# EAGLE design utility hat (EAGLE 6.3)
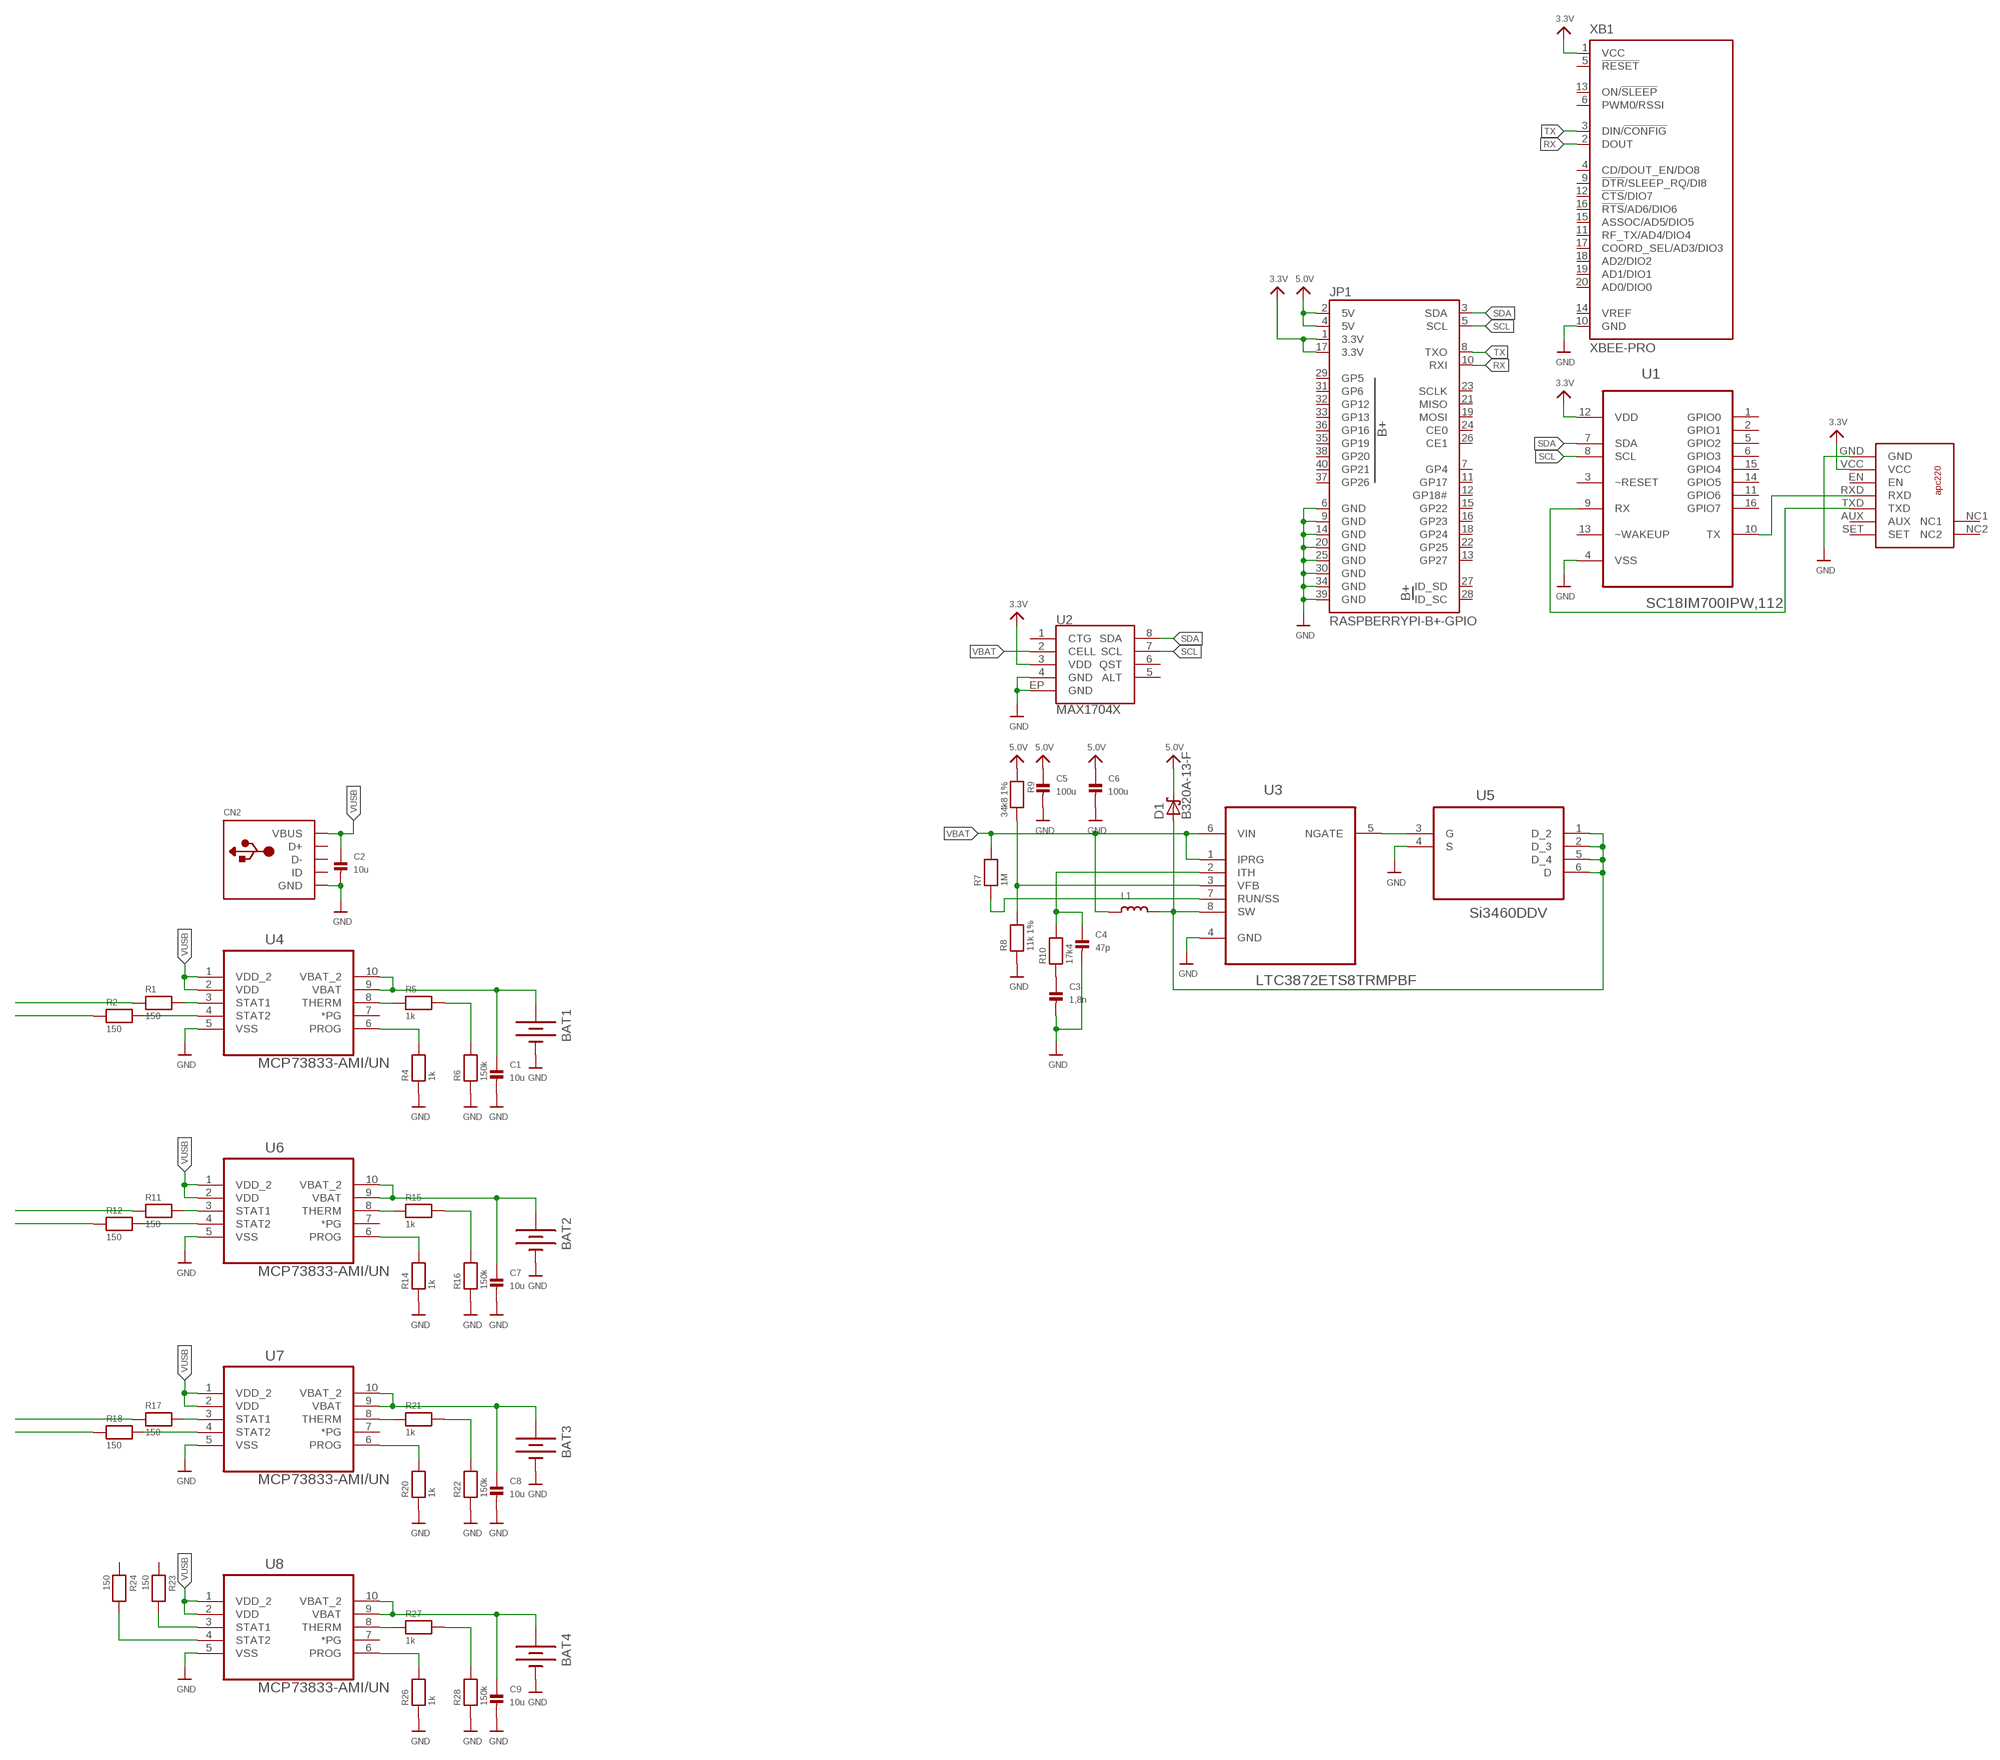
[diagram p0: schematic, sheet 1]

## Parts
BAT1  BATTERY18650  [BATTERY_18650-HOLDER]
BAT2  BATTERY18650  [BATTERY_18650-HOLDER]
BAT3  BATTERY18650  [BATTERY_18650-HOLDER]
BAT4  BATTERY18650  [BATTERY_18650-HOLDER]
C1  10u  CAP_CERAMIC_0805MP  [_0805MP]
C2  10u  CAP_CERAMIC_0805MP  [_0805MP]
C3  1,8n  CAP_CERAMIC_0603MP  [_0603MP]
C4  47p  CAP_CERAMIC_0603MP  [_0603MP]
C5  100u  CAP_CERAMIC1206  [1206]
C6  100u  CAP_CERAMIC1206  [1206]
C7  10u  CAP_CERAMIC_0805MP  [_0805MP]
C8  10u  CAP_CERAMIC_0805MP  [_0805MP]
C9  10u  CAP_CERAMIC_0805MP  [_0805MP]
CN2  USBMINIB  [USB-MINIB]
D1  B320A-13-F  MBRS320T3  [SMC]
JP1  RASPBERRYPI-B+-GPIO  [2X20-SHROUDED]
L1  INDUCTOR  [INDUCTOR_1007]
R1  150  RESISTOR_0603MP  [_0603MP]
R2  150  RESISTOR_0603MP  [_0603MP]
R4  1k  RESISTOR_0603MP  [_0603MP]
R5  1k  RESISTOR_0603MP  [_0603MP]
R6  150k  RESISTOR_0603MP  [_0603MP]
R7  1M  RESISTOR_0603MP  [_0603MP]
R8  11k 1%  RESISTOR_0603MP  [_0603MP]
R9  34k8 1%  RESISTOR_0603MP  [_0603MP]
R10  17k4  RESISTOR_0603MP  [_0603MP]
R11  150  RESISTOR_0603MP  [_0603MP]
R12  150  RESISTOR_0603MP  [_0603MP]
R14  1k  RESISTOR_0603MP  [_0603MP]
R15  1k  RESISTOR_0603MP  [_0603MP]
R16  150k  RESISTOR_0603MP  [_0603MP]
R17  150  RESISTOR_0603MP  [_0603MP]
R18  150  RESISTOR_0603MP  [_0603MP]
R20  1k  RESISTOR_0603MP  [_0603MP]
R21  1k  RESISTOR_0603MP  [_0603MP]
R22  150k  RESISTOR_0603MP  [_0603MP]
R23  150  RESISTOR_0603MP  [_0603MP]
R24  150  RESISTOR_0603MP  [_0603MP]
R26  1k  RESISTOR_0603MP  [_0603MP]
R27  1k  RESISTOR_0603MP  [_0603MP]
R28  150k  RESISTOR_0603MP  [_0603MP]
U1  SC18IM700IPW,112  [SOP65P640X110-16N]
U2  MAX1704X  [TDFN-8]
U3  LTC3872ETS8TRMPBF  [SOT65P280X100-8N]
U4  MCP73833-AMI/UN  [SOP50P490X110-10N]
U5  Si3460DDV  SI3457CDV-T1-GE3  [SOT95P285X110-6N]
U6  MCP73833-AMI/UN  [SOP50P490X110-10N]
U7  MCP73833-AMI/UN  [SOP50P490X110-10N]
U8  MCP73833-AMI/UN  [SOP50P490X110-10N]
U$10  APC220  [APC220]
XB1  XBEE-PRO  [XBEE-PRO]

## Nets
3.3V: JP1.1(3.3V) JP1.17(3.3V) U1.12(VDD) U2.3(VDD) U$10.VCC XB1.1(VCC)
5.0V: C5.1 C6.1 D1.C JP1.2(5V) JP1.4(5V) R9.1
GND: BAT1.GND@1(-) BAT2.GND@1(-) BAT3.GND@1(-) BAT4.GND@1(-) C1.2 C2.2 C3.2 C4.2 C5.2 C6.2 C7.2 C8.2 C9.2 CN2.GND JP1.6(GND) JP1.9(GND) JP1.14(GND) JP1.20(GND) JP1.25(GND) JP1.30(GND) JP1.34(GND) JP1.39(GND) R4.1 R6.1 R8.1 R14.1 R16.1 R20.1 R22.1 R26.1 R28.1 U1.4(VSS) U2.4(GND) U2.EP(GND) U3.4(GND) U4.5(VSS) U5.4(S) U6.5(VSS) U7.5(VSS) U8.5(VSS) U$10.GND XB1.10(GND)
N$1: U1.10(TX) U$10.RXD
N$2: U1.9(RX) U$10.TXD
N$4: R1.2 U4.3(STAT1)
N$5: R2.2 U4.4(STAT2)
N$8: R2.1
N$9: R1.1
N$11: R4.2 U4.6(PROG)
N$12: R5.1 U4.8(THERM)
N$13: R5.2 R6.2
N$14: R7.1 U3.7(RUN/SS)
N$15: R8.2 R9.2 U3.3(VFB)
N$16: C4.1 R10.2 U3.2(ITH)
N$17: C3.1 R10.1
N$19: D1.A L1.P$2 U3.8(SW) U5.1(D_2) U5.2(D_3) U5.5(D_4) U5.6(D)
N$21: U3.5(NGATE) U5.3(G)
N$22: BAT1.PWR@1(+) C1.1 U4.9(VBAT) U4.10(VBAT_2)
N$26: R11.2 U6.3(STAT1)
N$27: R12.2 U6.4(STAT2)
N$30: R12.1
N$31: R11.1
N$32: R14.2 U6.6(PROG)
N$33: R15.1 U6.8(THERM)
N$34: R15.2 R16.2
N$35: BAT2.PWR@1(+) C7.1 U6.9(VBAT) U6.10(VBAT_2)
N$37: R17.2 U7.3(STAT1)
N$38: R18.2 U7.4(STAT2)
N$41: R18.1
N$42: R17.1
N$43: R20.2 U7.6(PROG)
N$44: R21.1 U7.8(THERM)
N$45: R21.2 R22.2
N$46: BAT3.PWR@1(+) C8.1 U7.9(VBAT) U7.10(VBAT_2)
N$48: R23.2 U8.3(STAT1)
N$49: R24.2 U8.4(STAT2)
N$54: R26.2 U8.6(PROG)
N$55: R27.1 U8.8(THERM)
N$56: R27.2 R28.2
N$57: BAT4.PWR@1(+) C9.1 U8.9(VBAT) U8.10(VBAT_2)
RX: JP1.10(RXI) XB1.2(DOUT)
SCL: JP1.5(SCL) U1.8(SCL) U2.7(SCL)
SDA: JP1.3(SDA) U1.7(SDA) U2.8(SDA)
TX: JP1.8(TXO) XB1.3(DIN/!CONFIG)
VBAT: L1.P$1 R7.2 U2.2(CELL) U3.1(IPRG) U3.6(VIN)
VUSB: C2.1 CN2.VBUS U4.1(VDD_2) U4.2(VDD) U6.1(VDD_2) U6.2(VDD) U7.1(VDD_2) U7.2(VDD) U8.1(VDD_2) U8.2(VDD)
Unconnected: CN2.D+ CN2.D- CN2.ID JP1.7(GP4) JP1.11(GP17) JP1.12(GP18#) JP1.13(GP27) JP1.15(GP22) JP1.16(GP23) JP1.18(GP24) JP1.19(MOSI) JP1.21(MISO) JP1.22(GP25) JP1.23(SCLK) JP1.24(CE0) JP1.26(CE1) JP1.27(ID_SD) JP1.28(ID_SC) JP1.29(GP5) JP1.31(GP6) JP1.32(GP12) JP1.33(GP13) JP1.35(GP19) JP1.36(GP16) JP1.37(GP26) JP1.38(GP20) JP1.40(GP21) R23.1 R24.1 U1.1(GPIO0) U1.2(GPIO1) U1.3(~RESET) U1.5(GPIO2) U1.6(GPIO3) U1.11(GPIO6) U1.13(~WAKEUP) U1.14(GPIO5) U1.15(GPIO4) U1.16(GPIO7) U2.1(CTG) U2.5(ALT) U2.6(QST) U4.7(*PG) U6.7(*PG) U7.7(*PG) U8.7(*PG) U$10.AUX U$10.EN U$10.NC1 U$10.NC2 U$10.SET XB1.4(CD/DOUT_EN/DO8) XB1.5(!RESET) XB1.6(PWM0/RSSI) XB1.9(!DTR!/SLEEP_RQ/DI8) XB1.11(RF_TX/AD4/DIO4) XB1.12(!CTS!/DIO7) XB1.13(ON/!SLEEP) XB1.14(VREF) XB1.15(ASSOC/AD5/DIO5) XB1.16(!RTS!/AD6/DIO6) XB1.17(COORD_SEL/AD3/DIO3) XB1.18(AD2/DIO2) XB1.19(AD1/DIO1) XB1.20(AD0/DIO0)

## Library data of the parts
BAT1-BAT4 = SparkFun-Electromechanical:BATTERY: Battery Holders Various common sizes : AA, AAA, 18650 (PRT-12895), 20mm coin cell and 12mm coin cell. 20MM_4LEGS, BATT-10373
C1-C9 = microbuilder:CAP_CERAMIC: Ceramic Capacitors 0402 - 0402 Surface Mount Capacitors 16pF 50V 5% [Digikey: 445-4899-2-ND] 18pF 50V 5% [Digikey: 490-1281-2-ND] 22pF 50V 5% [Digikey: 490-1283-2-ND] 68pF 50V 5% [Digikey: 490-1289-2-ND] 0.1uF 10V 10% [Digikey: 490-1318-2-ND] 1.0uF 6.3V 10% [Digikey: 490-1320-2-ND] 0603 - 0603 Surface Mount Capacitors 16 pF 50V 5% [Digikey: 445-5051-2-ND] 22 pF 50V [Digikey: PCC220ACVTR-ND] 33 pF 50V 5% [Digikey: 490-1415-1-ND] 56pF 50V 5% [Digikey: 490-1421-1-ND] 220pF 50V 5% [Digikey: 445-1285-1-ND] 680 pF 50V 2200 pF 50V 5% C0G [Digikey: 445-1297-1-ND] 5600 pF 100V 5% X7R [Digikey: 478-3711-1-ND] 0.1 µF 25V 10% [Digikey: PCC2277TR-ND] 0.22 µF 16V 10% X7R [Digikey: 445-1318-1-ND] 1.0 µF 25V 10% [Digikey: 445-5146-2-ND] 0603 - RF Specific 3pF 250V +/-0.1pF RF [Digikey: 712-1347-1-ND] 18 pF 250V 5% [Digikey: 478-3505-1-ND or 712-1322-1-ND] 56 pF 250V 5% C0G RF [Digikey: 490-4867-1-ND] 68 pF 250V RF [Digikey: 490-4868-1-ND] 0805 - 0805 Surface Mount Capacitors 220 pF 250V 2% RF Ceramic Capacitor [Digikey: 712-1398-1-ND] 1000 pF 50V 2% NP0 Ceramic Capacitor [Digikey: 478-3760-1-ND] 0.1 µF 25V 10% Ceramic Capacitor [Digikey: PCC1828TR-ND] 1.0 µF 16V 10% Ceramic Capacitor[Digikey: 490-1691-2-ND] 10.0 µF 10V 10% Ceramic Capacitor[Digikey: 709-1228-1-ND] 10.0 uF 16V 10% Ceramic Capacitor [Digikey: 478-5165-2-ND] 47 uF 6.3V 20% Ceramic Capacitor [Digikey: 587-1779-1-ND or 399-5506-1-ND] 1206 - 1206 Surface Mount Capacitors 47uF 10V 20% Ceramic Capacitor [Digikey: 490-5528-1-ND or 399-5508-1-ND or 445-6010-1-ND] 100uF 6.3V -20%, +80% Y5V Ceramic Capacitor (Digikey: 490-4512-1-ND, Mouser: 81-GRM31CF50J107ZE1L)
CN2 = adafruit:USB: USB Connectors USBMINIB - Surface Mount Female Mini-B USB Connector 4UConnector: 06564 By microbuilder.eu Thru-hole RA Female Mini-B USB Connector 4UConnector: 18732 By ladyada.net
D1 = diode:MBRS3*0T3: SCHOTTKY BARRIER RECTIFIER 3.0 AMPERES 20, 30, 40 VOLT Source: MBRS340T3-D.pdf
JP1 = SparkFun-Boards:RASPBERRYPI-B+-GPIO: Raspberry Pi B+ GPIO Header 2x20 pin connector
L1 = microbuilder:INDUCTOR: Inductors 0603: 10nH Ceramic Inductor - microwire antenna/RF (Digikey: 712-1434-2-ND) 0805: 560nH Ceramic Inductor - RF (Digikey: 553-1047-1-ND) 270nH Ceramic Inductor - Q = 40@250MHz, +-5%, 1 Ohm DC Resistance (Digikey: 535-10506-2-ND) 1007 (2518 Metric) SMT: 10µH 10% 250mOhm 820mA 1007 Inductor (Digikey: 587-2189-1-ND) 22µH 10% 500mOhm 580mA 1007 Inductor (Digikey: 587-2190-1-ND) 47µH 10% 950mOhm 420mA 1007 Inductor (Digikey: 587-2191-1-ND) 47µH 5% 100mOhm 1A 1008 Inductor (Digikey: 732-1816-1-ND) 5.0x5.0mm (Taiyo Yuden NR5040 Series) 6.8µH 20% 2.3A 64mOhm Inductor (Digikey: 587-2374-2-ND) 5.0x5.0mm (TDK VLC5045 Series) 4.7µH 20% 3.3A 34mOhm Inductor (Digikey: 445-6526-1-ND) 6.8µH 20% 2.7A 46mOhm Inductor (Digikey: 445-6527-1-ND) 6.0x6.0mm (TDK VLC6045 Series) 4.7µH 20% 3.8A 27mOhm Inductor (Digikey: 445-6538-2-ND) 6.8µH 20% 3A 41mOhm Inductor (Digikey: 445-6540-1-ND) 6.2µH 30% 2.2A 45mOhm Inductor (Digikey: SRR5028-6R2YCT-ND) - Not TDK VLC6045 but footprint should match 6.0x6.0mm (TDK SLF6045 Series) 6.8uH 30% 2A 33mOhm Inductor (Digikey: 445-4572-1-ND, Mouser: 810-SLF645T6R8N2R0PF)
R1 R2 R4-R12 R14-R18 R20-R24 R26-R28 = microbuilder:RESISTOR: Resistors 0402 - 0402 Surface Mount Package 22 Ohm 1% 1/16W [Digikey: 311-22.0LRTR-ND] 33 Ohm 5% 1/16W 1.0K 5% 1/16W 1.5K 5% 1/16W 2.0K 1% 1/16W 10.0K 1% 1/16W [Digikey: 311-10.0KLRTR-ND] 10.0K 5% 1/16W [Digikey: RMCF0402JT10K0TR-ND] 12.1K 1% 1/16W [Digikey: 311-22.0LRTR-ND] 100.0K 5% 1/16W 0603 - 0603 Surface Mount Package 0 Ohm 1/10 Watt 1% Resistor 15 Ohm 1/10 Watt 1% Resistor 33 Ohm 1/10 Watt 1% Resistor 49.9 Ohm 1/10 Watt 1% Resistor 100 Ohm 1/10 Watt 1% Resistor 150 Ohm 1/10 Watt 1% Resistor 240 Ohm 1/10 Watt 1% Resistor 390 Ohm 1/10 Watt 1% Resistor 560 Ohm 1/10 Watt 1% Resistor 680 Ohm 1/10 Watt 1% Resistor 750 Ohm 1/10 Watt 1% Resistor 1.0K Ohm 1/10 Watt 1% Resistor 1.5K Ohm 1/10 Watt 1% Resistor 2.0K Ohm 1/10 Watt 1% Resistor 2.2K Ohm 1/10 Watt 1% Resistor 3.3K Ohm 1/10 Watt 1% Resistor 4.7K Ohm 1/10 Watt 1% Resistor 10.0K Ohm 1/10 Watt 1% Resistor 12.0K Ohm 1/10 Watt 1% Resistor 12.1K Ohm 1/10 Watt 1% Resistor 20.0K Ohm 1/10 Watt 1% Resistor 33.0K Ohm 1/10 Watt 1% Resistor 100.0K Ohm 1/10 Watt 1% Resistor 0805 - 0805 Surface Mount Package 0 Ohm 1/8 Watt 1% Resistor 33 Ohm 1/8 Watt 1% Resistor 100 Ohm 1/8 Watt 1% Resistor 150 Ohm 1/8 Watt 1% Resistor 200 Ohm 1/8 Watt 1% Resistor 240 Ohm 1/8 Watt 1% Resistor 330 Ohm 1/8 Watt 1% Resistor 390 Ohm 1/8 Watt 1% Resistor 470 Ohm 1/8 Watt 1% Resistor 1.0K Ohm 1/8 Watt 1% Resistor 1.5K Ohm 1/8 Watt 1% Resistor 2.0K Ohm 1/8 Watt 1% Resistor 4.7K Ohm 1/8 Watt 1% Resistor 5.1K Ohm 1/8 Watt 1% Resistor 5.6K Ohm 1/8 Watt 1% Resistor 10.0K Ohm 1/8 Watt 1% Resistor 22.0K Ohm 1/8 Watt 1% Resistor 33.0K Ohm 1/8 Watt 1% Resistor 100K Ohm 1/8 Watt 1% Resistor 1206 - 1206 Surface Mount Package 2012 - 2010 Surface Mount Package 0.11 Ohm 1/2 Watt 1% Resistor - Digikey: RHM.11UCT-ND
U1 = NXP_By_element14_Batch_1:SC18IM700IPW,112: Master I2C-bus controller with UART interface; MPN: SC18IM700IPW,112; OC_FARNELL: -; OC_NEWARK: 70R9006; PACKAGE: TSSOP-16; SUPPLIER: NXP
U2 = SparkFun-PowerIC:MAX1704X: MAX17043/MAX17044: Battery Fuel Guage (43 is 1cell, 44 is 2cell); PROD-ID: IC-10399
U3 = LTC_By_element14_Batch_1:LTC3872ETS8TRMPBF: DC/DC Controller; MPN: LTC3872ETS8#TRMPBF; OC_FARNELL: 1556409; OC_NEWARK: 56M8617; PACKAGE: SOT-23-8; SUPPLIER: LINEAR TECHNOLOGY
U4 U6-U8 = Microchip_By_element14_Batch_1:MCP73833-AMI/UN: IC, BATTERY CHARGER, 1A; MPN: MCP73833-AMI/UN; OC_FARNELL: 1332160; OC_NEWARK: 88K5664; PACKAGE: MSOP-10; SUPPLIER: Microchip
U5 = Vishay_By_element14_Batch_1:SI3457CDV-T1-GE3: N-Channel 30-V (D-S) MOSFET; MPN: SI3457CDV-T1-GE3; OC_FARNELL: 1840420; OC_NEWARK: 90R9127; PACKAGE: TSOP-6; SUPPLIER: Vishay Siliconix
U$10 = APC220:APC220
XB1 = microbuilder:XBEE: XBee (TM) /XBee-PRO(TM) OEM RF Modules Source: MaxStream, Inc. xbee_productmanual.pdf

## Board
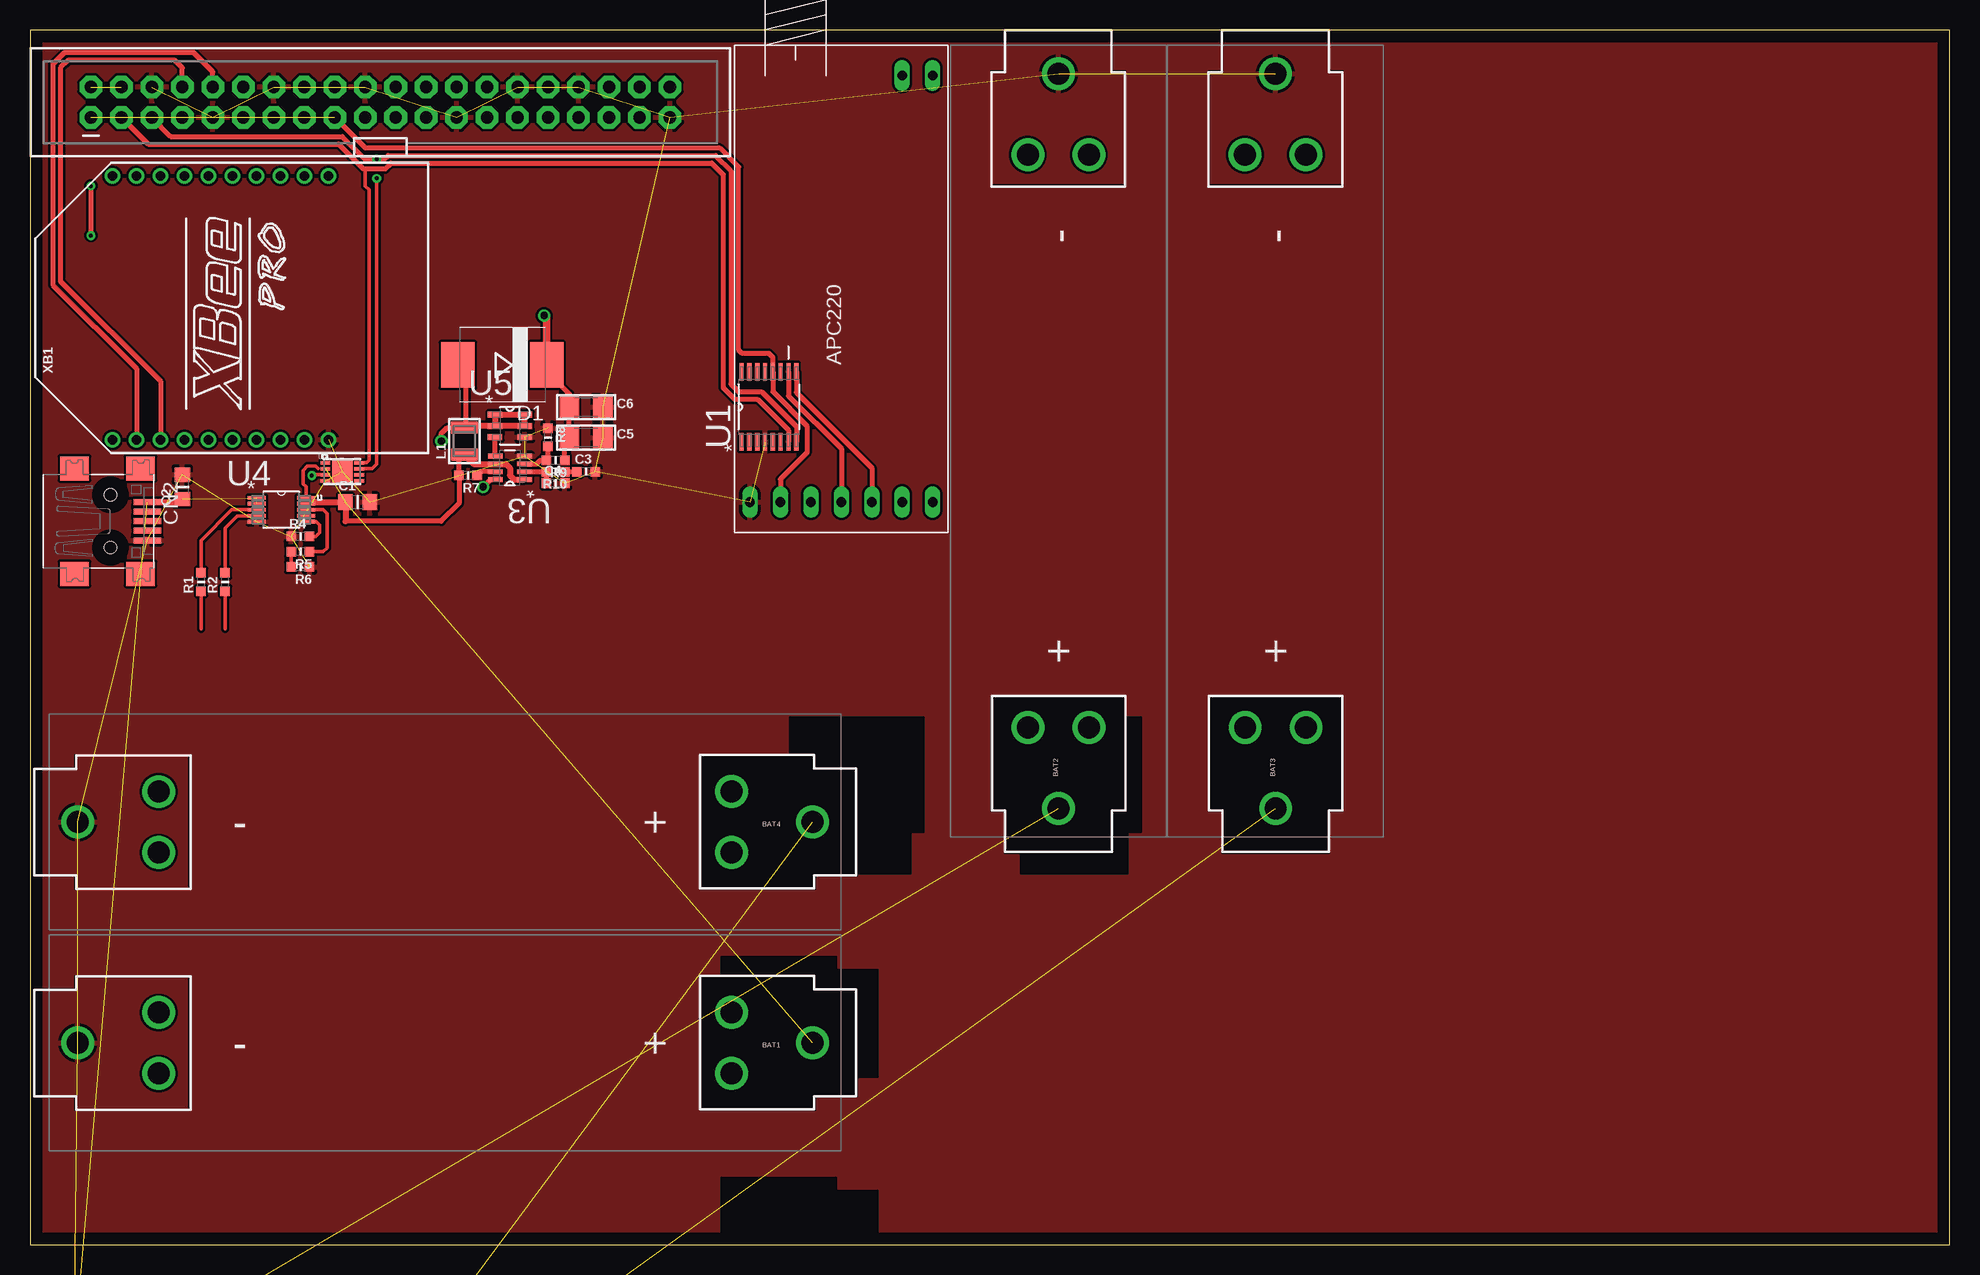
[diagram p1: board, top side]
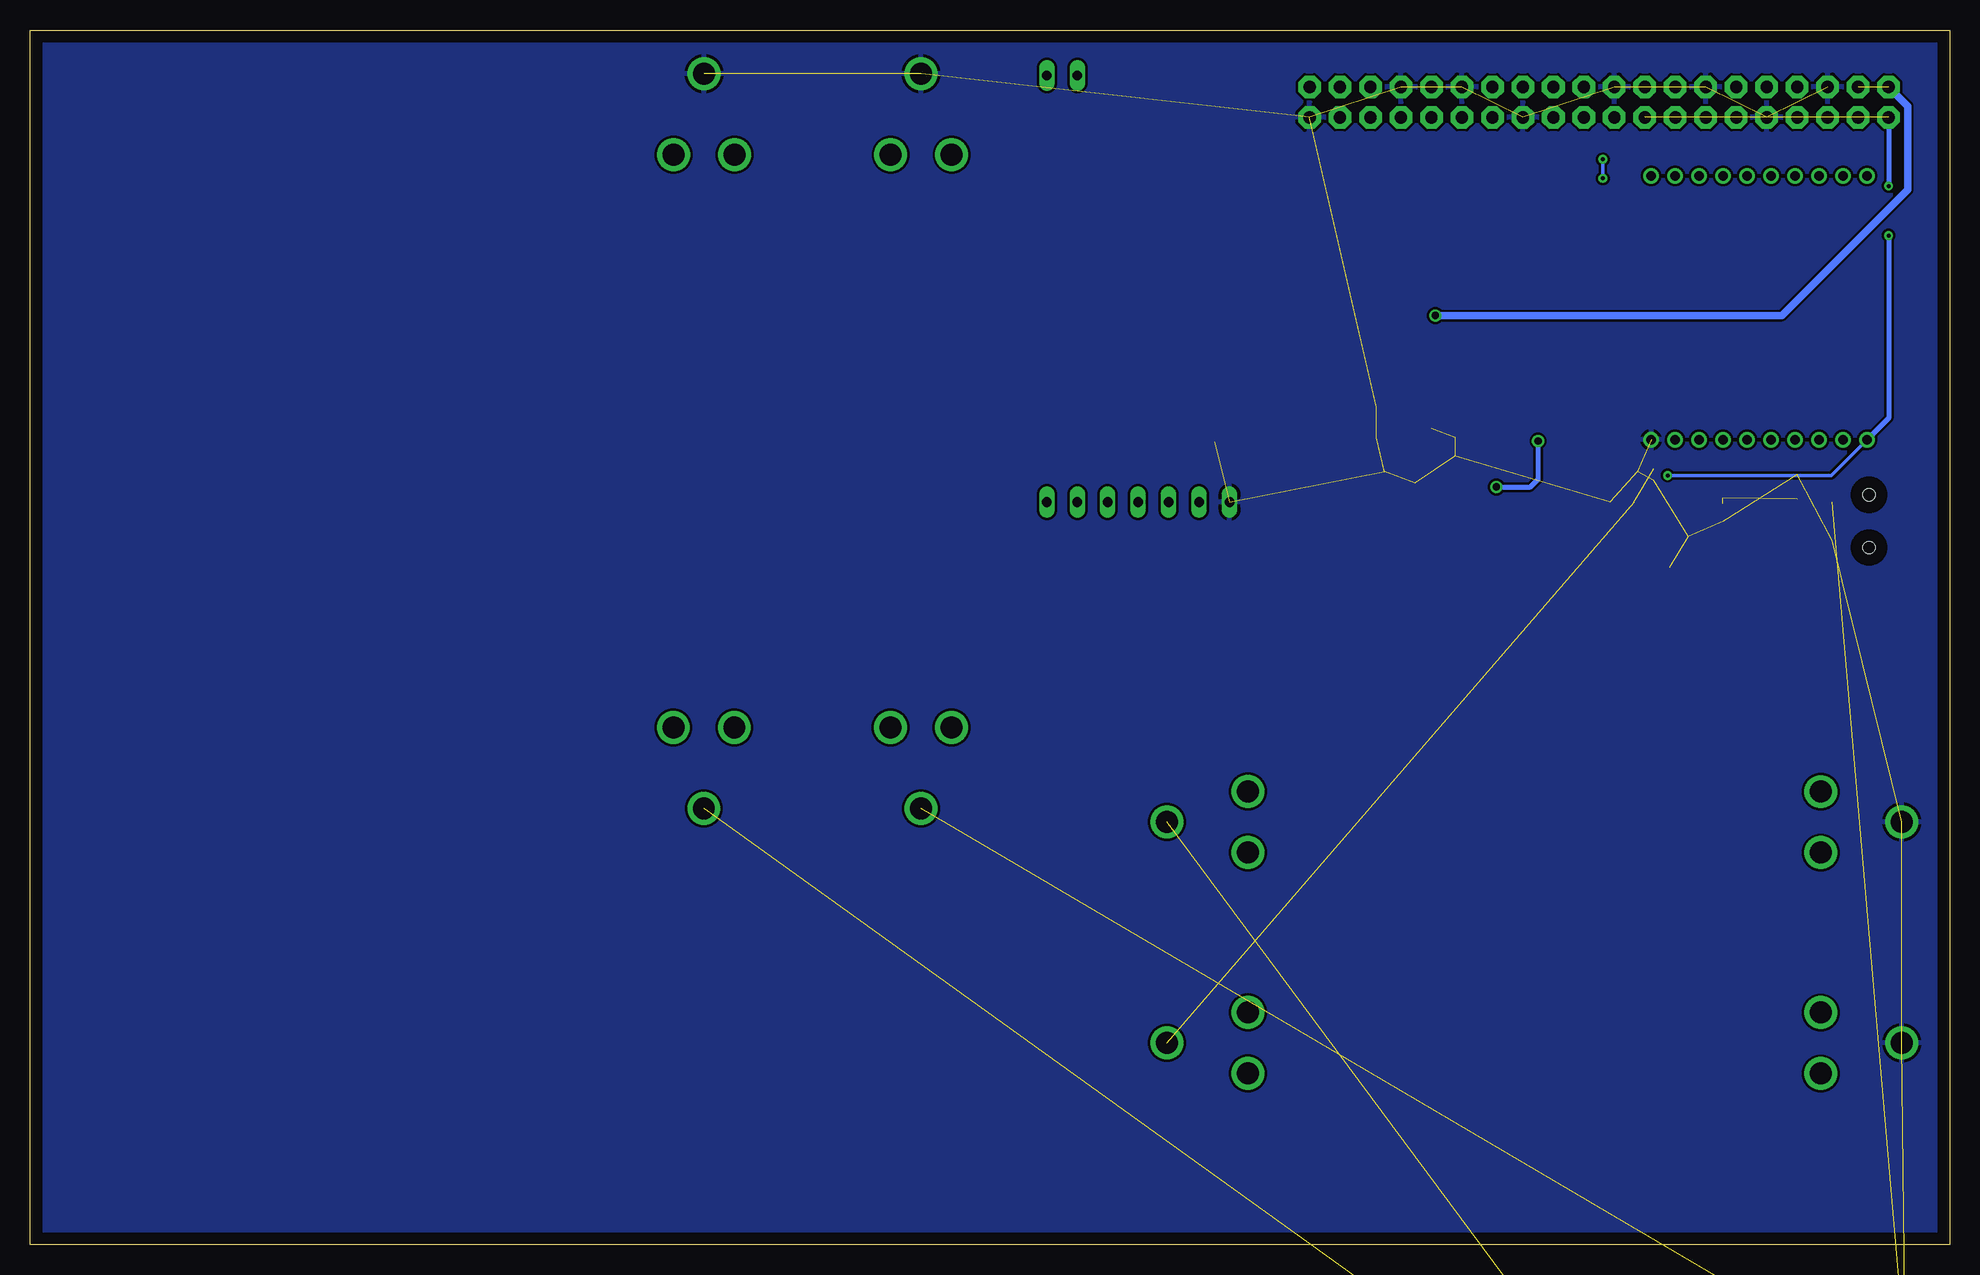
[diagram p2: board, bottom side, seen from below]

Size 160 x 101.27 mm. Coordinates in mm from the lower left corner, seen from the top.
Outline: 0,0 160,0 160,101.27 0,101.27 0,0
Copper layers (1*16): Top 0.035mm / dielectric 1.5mm / Bottom 0.035mm
Design rules "default": minimum track width 10mil, minimum drill 24mil, track to track 8mil, track to pad 8mil, pad to pad 8mil, via to via 8mil, smd to smd 8mil, copper to edge 40mil, drill to drill 8mil, minimum pad ring 10mil, minimum via ring 8mil, stop-mask expansion 4mil, vias tented up to drill 0mil, thermal gap 10mil

### Footprints (pad centres in the part's own frame; a part is rotated, then mirrored left to right if it is on the bottom)
BATTERY_18650-HOLDER = drill 1.829: GND@1 30.628,0.01; GND@2 23.88,2.55; GND@3 23.88,-2.53; PWR@1 -30.628,-0.01; PWR@2 -23.88,2.53; PWR@3 -23.88,-2.55
_0805MP = smd 1.2 x 1.3: 1 -1.016,0; 2 1.016,0
_0603MP = smd 0.8 x 0.8: 1 -0.762,0; 2 0.762,0
1206 = smd 1.6 x 1.8: 1 -1.4,0; 2 1.4,0
USB-MINIB = smd 0.5 x 2.308: D+ 0,4.064; D- -0.8,4.064; GND 1.6,4.064; ID 0.8,4.064; VBUS -1.6,4.064 | smd 2 x 2.4: GND1 -4.4,-2; GND2 -4.4,3.5; GND3 4.4,3.5; GND4 4.4,-2 | hole 1: -2.2,1; 2.2,1
SMC = smd 2.8 x 3.8: A 3.7,0; C -3.7,0
2X20-SHROUDED = drill 1.016 pad 1.88 octagon: 1 -1.27,24.13; 2 1.27,24.13; 3 -1.27,21.59; 4 1.27,21.59; 5 -1.27,19.05; 6 1.27,19.05; 7 -1.27,16.51; 8 1.27,16.51; 9 -1.27,13.97; 10 1.27,13.97; 11 -1.27,11.43; 12 1.27,11.43; 13 -1.27,8.89; 14 1.27,8.89; 15 -1.27,6.35; 16 1.27,6.35; 17 -1.27,3.81; 18 1.27,3.81; 19 -1.27,1.27; 20 1.27,1.27; 21 -1.27,-1.27; 22 1.27,-1.27; 23 -1.27,-3.81; 24 1.27,-3.81; 25 -1.27,-6.35; 26 1.27,-6.35; 27 -1.27,-8.89; 28 1.27,-8.89; 29 -1.27,-11.43; 30 1.27,-11.43; 31 -1.27,-13.97; 32 1.27,-13.97; 33 -1.27,-16.51; 34 1.27,-16.51; 35 -1.27,-19.05; 36 1.27,-19.05; 37 -1.27,-21.59; 38 1.27,-21.59; 39 -1.27,-24.13; 40 1.27,-24.13
INDUCTOR_1007 = smd 1.016 x 2.2: P$1 -1.127,0; P$2 1.127,0
SOP65P640X110-16N = smd 1.473 x 0.356: 1 -2.921,2.286; 2 -2.921,1.626; 3 -2.921,0.965; 4 -2.921,0.33; 5 -2.921,-0.33; 6 -2.921,-0.965; 7 -2.921,-1.626; 8 -2.921,-2.286; 9 2.921,-2.286; 10 2.921,-1.626; 11 2.921,-0.965; 12 2.921,-0.33; 13 2.921,0.33; 14 2.921,0.965; 15 2.921,1.626; 16 2.921,2.286
TDFN-8 = smd 0.8 x 0.3: 1 -1.4,0.75; 2 -1.4,0.25; 3 -1.4,-0.25; 4 -1.4,-0.75; 5 1.4,-0.75; 6 1.4,-0.25; 7 1.4,0.25; 8 1.4,0.75 | smd 1.73 x 1.88: EP 0,0
SOT65P280X100-8N = smd 1.219 x 0.406: 1 -1.219,0.965; 2 -1.219,0.33; 3 -1.219,-0.33; 4 -1.219,-0.965; 5 1.219,-0.965; 6 1.219,-0.33; 7 1.219,0.33; 8 1.219,0.965
SOP50P490X110-10N = smd 1.499 x 0.305: 1 -2.057,0.991; 2 -2.057,0.508; 3 -2.057,0; 4 -2.057,-0.508; 5 -2.057,-0.991; 6 2.057,-0.991; 7 2.057,-0.508; 8 2.057,0; 9 2.057,0.508; 10 2.057,0.991
SOT95P285X110-6N = smd 1.219 x 0.508: 1 -1.245,0.94; 2 -1.245,0; 3 -1.245,-0.94; 4 1.245,-0.94; 5 1.245,0; 6 1.245,0.94
APC220 = drill 0.8 long: AUX -10.16,-5.08; EN -10.16,2.54; GND -10.16,7.62; NC1 25.4,-5.08; NC2 25.4,-7.62; RXD -10.16,0; SET -10.16,-7.62; TXD -10.16,-2.54; VCC -10.16,5.08
XBEE-PRO = drill 0.8 pad 1.27: 1 -11,9; 2 -11,7; 3 -11,5; 4 -11,3; 5 -11,1; 6 -11,-1; 7 -11,-3; 8 -11,-5; 9 -11,-7; 10 -11,-9; 11 11,-9; 12 11,-7; 13 11,-5; 14 11,-3; 15 11,-1; 16 11,1; 17 11,3; 18 11,5; 19 11,7; 20 11,9

### Placement (x,y rotation side)
BAT1  34.61,16.83 180 top
BAT2  85.72,66.99 90 top
BAT3  103.82,66.99 90 top
BAT4  34.61,35.24 180 top
C1  27.3,61.91 0 top
C2  12.7,63.18 90 top
C3  46.35,64.45 0 top
C4  43.81,63.5 0 top
C5  46.35,67.31 0 top
C6  46.35,69.85 0 top
C7  1.59,-26.99 0 top  (outside the outline)
C8  19.37,-59.69 0 top  (outside the outline)
C9  23.5,-59.69 0 top  (outside the outline)
CN2  5.71,60.33 270 top
D1  39.37,73.34 180 top
JP1  29.21,95.25 90 top
L1  36.2,66.99 90 top
R1  14.26,55.24 90 top
R2  16.26,55.24 90 top
R4  22.54,59.05 0 top
R5  22.54,57.78 180 top
R6  22.54,56.52 180 top
R7  36.51,64.14 180 top
R8  43.18,67.31 270 top
R9  43.81,65.41 180 top
R10  43.81,64.45 180 top
R11  5.08,-26.67 0 top  (outside the outline)
R12  8.26,-26.67 0 top  (outside the outline)
R14  14.61,-26.67 0 top  (outside the outline)
R15  17.78,-26.67 0 top  (outside the outline)
R16  20.95,-26.67 0 top  (outside the outline)
R17  26.99,-59.37 0 top  (outside the outline)
R18  30.16,-59.37 0 top  (outside the outline)
R20  4.13,-68.9 0 top  (outside the outline)
R21  7.3,-68.9 0 top  (outside the outline)
R22  10.48,-68.9 0 top  (outside the outline)
R23  13.65,-68.9 0 top  (outside the outline)
R24  16.83,-68.9 0 top  (outside the outline)
R26  23.18,-68.9 0 top  (outside the outline)
R27  26.35,-68.9 0 top  (outside the outline)
R28  29.53,-68.9 0 top  (outside the outline)
U1  61.59,69.85 90 top
U2  26.04,64.45 0 top
U3  40.01,64.77 180 top
U4  20.95,61.28 0 top
U5  40.01,68.26 0 top
U6  5.71,-10.48 0 top  (outside the outline)
U7  5.71,-33.66 0 top  (outside the outline)
U8  5.71,-43.18 0 top  (outside the outline)
U$10  67.63,72.07 90 top
XB1  15.88,78.11 90 top

### Tracks (layer width: path | path; a pad name or v marks a point on that pad's centre or on a via)
3.3V  (via drill 0.33)  (1 unrouted)
  Top 0.305: U2.3 23.56,64.2 v23.5,64.14
  Top 0.406: JP1.17 27.94,91.44 57.47,91.44 59.07,89.84 59.07,74.6 59.37,74.3 61.59,74.3 61.92,73.97 U1.12 61.92,71.11 64.77,68.26 64.77,66.04 62.55,63.82 U$10.VCC | v5.08,88.27 v5.08,84.14
  Bottom 0.305: v23.5,64.14 9.85,64.14 XB1.1
  Bottom 0.406: XB1.1 5.08,68.9 v5.08,84.14 | JP1.1 v5.08,88.27
5.0V  (via drill 0.6)  (1 unrouted)
  Top 0.406: R9.1 44.58,66.74 C5.1 C6.1 44.95,70.93 43.07,72.82 D1.C
  Top 0.61: D1.C 43.07,77.26 v42.86,77.47
  Bottom 0.61: v42.86,77.47 13.97,77.47 3.49,87.95 3.49,94.93 JP1.2
GND  (41 unrouted)
  pour Bottom: 0,101.28 160.02,101.28 160.02,0 0,0
  pour Top: 0,101.28 160.02,101.28 160.02,0 0,0
N$1
  Top 0.406: U1.10 63.22,70.76 67.63,66.36 U$10.RXD
N$2
  Top 0.406: U1.9 63.88,71.06 70.17,64.77 U$10.TXD
N$4
  Top 0.305: U4.3 16.83,61.28 14.26,58.71 R1.2
N$5
  Top 0.305: U4.4 17.27,60.77 16.26,59.75 R2.2
N$8
  Top 0.305: R2.1 16.26,51.34
N$9
  Top 0.305: R1.1 14.26,51.34
N$11
  Top 0.305: R4.2 23.81,59.05 24.13,59.37 24.13,60.01 23.85,60.29 U4.6
N$12
  Top 0.305: U4.8 24.45,61.28 24.77,60.96 24.77,58.1 24.45,57.78 R5.1
N$13
  Top 0.305: R5.2 R6.2
N$14
  Top 0.406: U3.7 37.58,64.44 R7.1
N$15
  Top 0.406: U3.3 42.24,65.1 42.55,65.41 R9.2 43.18,65.53 R8.2
N$16
  Top 0.406: U3.2 R10.2 C4.1
N$17
  Top 0.406: R10.1 C3.1
N$19  (via drill 0.6)
  Top 0.406: 36.34,68.26 36.34,72.67 D1.A | U3.8 38.41,63.8 v37.78,63.18 | v34.29,66.99 34.29,67.63 34.78,68.12 L1.P$2
  Top 0.508: U5.2 U5.5 U5.6 U5.1 38.76,68.29 38.73,68.26 36.34,68.26 L1.P$2
  Bottom 0.406: v37.78,63.18 34.92,63.18 34.29,63.82 v34.29,66.99
N$21
  Top 0.406: U3.5 38.76,65.76 U5.3
N$22  (1 unrouted)
  Top 0.305: 23.39,62.17 U4.9 U4.10 23.01,63.19 22.77,63.44 22.77,64.55 23.11,64.9 23.81,64.9 24.01,64.7
  Top 0.508: 23.37,61.91 23.5,61.91 | 23.5,61.91 C1.1 | 23.39,62.17 23.5,62.06 23.5,61.91
N$26  (1 unrouted)
N$27  (1 unrouted)
N$32  (1 unrouted)
N$33  (1 unrouted)
N$34  (1 unrouted)
N$35  (3 unrouted)
N$37  (1 unrouted)
N$38  (1 unrouted)
N$43  (1 unrouted)
N$44  (1 unrouted)
N$45  (1 unrouted)
N$46  (3 unrouted)
N$48  (1 unrouted)
N$49  (1 unrouted)
N$54  (1 unrouted)
N$55  (1 unrouted)
N$56  (1 unrouted)
N$57  (3 unrouted)
RX
  Top 0.406: JP1.10 15.24,97.79 13.65,99.38 2.86,99.38 1.91,98.42 1.91,80.01 8.88,73.04 XB1.2
SCL  (via drill 0.33)
  Top 0.305: U2.7 28.51,64.7 28.89,65.09 v28.89,88.9
  Top 0.406: JP1.5 11.75,92.39 26.04,92.39 27.94,90.49 v28.89,90.49 29.53,90.49 29.84,90.81 57.15,90.81 58.42,89.53 58.42,71.75 59.05,71.12 60.96,71.12 63.88,68.2 U1.8
  Bottom 0.305: v28.89,88.9 v28.89,90.49
SDA
  Top 0.305: U2.8 28.05,65.2 28.26,65.41 28.26,87.95 27.94,88.27 27.94,89.69
  Top 0.406: JP1.3 9.84,91.76 25.72,91.76 27.78,89.69 27.94,89.69 29.62,89.69 30.1,90.17 56.83,90.17 57.78,89.22 57.78,71.44 58.74,70.48 60.64,70.48 63.22,67.91 U1.7
TX
  Top 0.406: JP1.8 12.7,98.11 12.06,98.74 3.17,98.74 2.54,98.11 2.54,80.33 10.88,71.99 XB1.3
VBAT  (1 unrouted)
  Top 0.406: L1.P$1 35.75,65.42 R7.2 35.75,61.78 34.29,60.33 26.3,60.33
  Top 0.508: 26.3,61.9 26.3,60.33 | L1.P$1 36.96,65.1 U3.6 39.67,65.1 40.01,64.77 40.01,64.14 40.34,63.8 U3.1
VUSB  (8 unrouted)
  Top 0.508: CN2.VBUS 12.7,61.92 C2.1